# Altium schematic sheet v2下.SchDoc
size A4; SheetNumber: 1; SheetTotal: 1
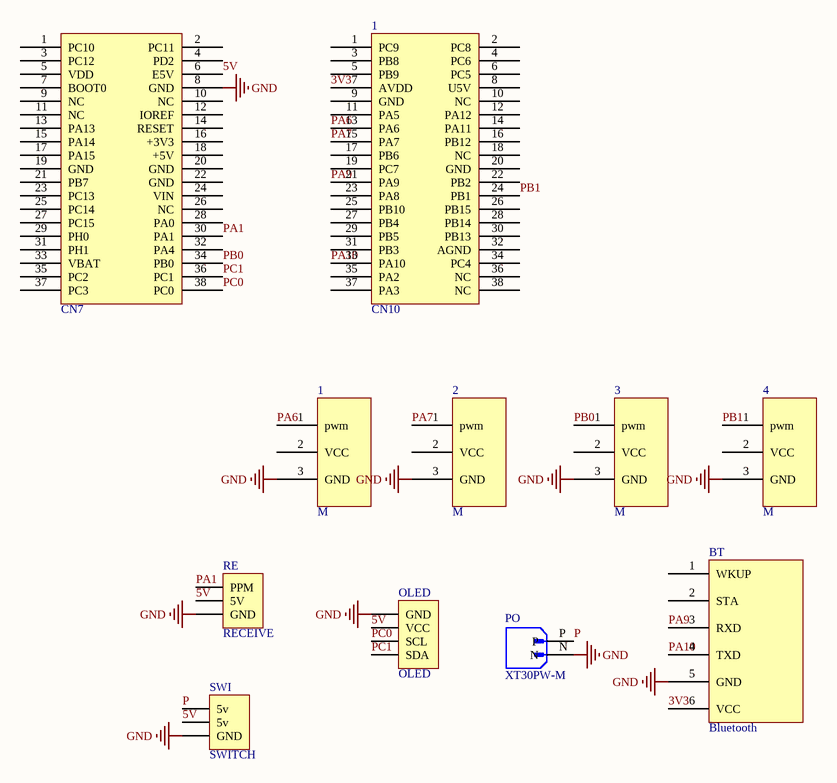
[diagram p0: v2下.SchDoc]

## Parts
(Parts that share a designator on the sheet are numbered #1, #2 ... from top to bottom, then left to right.)
1#1  CN10  [CN10]
1#2  M  [M]
2  M  [M]
3  M  [M]
4  M  [M]
BT  Bluetooth  [Bluetooth]
CN7  CN7  [CN7]  (value not drawn)
OLED  OLED  [HDR1X4]
PO  XT30PW-M  [AMASS_XT30PW-M]
RE  RECEIVE  [HDR1X3]
SWI  SWITCH  [HDR1X3]

## Nets
GND: 1#2.3(GND) 2.3(GND) 3.3(GND) 4.3(GND) BT.5(GND) CN7.8(GND) OLED.1(GND) PO.N RE.3(GND) SWI.3(GND)
3V3: 1#1.7(AVDD) BT.6(VCC)
5V: CN7.6(E5V) OLED.2(VCC) RE.2(5V) SWI.2(5v)
P: PO.P SWI.1(5v)
PA1: CN7.30(PA1) RE.1(PPM)
PA6: 1#1.13(PA6) 1#2.1(pwm)
PA7: 1#1.15(PA7) 2.1(pwm)
PA9: 1#1.21(PA9) BT.3(RXD)
PA10: 1#1.33(PA10) BT.4(TXD)
PB0: 3.1(pwm) CN7.34(PB0)
PB1: 1#1.24(PB1) 4.1(pwm)
PC0: CN7.38(PC0) OLED.3(SCL)
PC1: CN7.36(PC1) OLED.4(SDA)

Not connected (* = marked no-connect by the designer): 1#1 1(PC9) 2(PC8) 3(PB8) 4(PC6) 5(PB9) 6(PC5) 8(U5V) 9(GND) 10(NC) 11(PA5) 12(PA12) 14(PA11) 16(PB12) 17(PB6) 18(NC) 19(PC7) 20(GND) 22(PB2) 23(PA8) 25(PB10) 26(PB15) 27(PB4) 28(PB14) 29(PB5) 30(PB13) 31(PB3) 32(AGND) 34(PC4) 35(PA2) 36(NC) 37(PA3) 38(NC); 1#2 2(VCC); 2 2(VCC); 3 2(VCC); 4 2(VCC); BT 1(WKUP) 2(STA); CN7 1(PC10) 2(PC11) 3(PC12) 4(PD2) 5(VDD) 7(BOOT0) 9(NC) 10(NC) 11(NC) 12(IOREF) 13(PA13) 14(RESET) 15(PA14) 16(+3V3) 17(PA15) 18(+5V) 19(GND) 20(GND) 21(PB7) 22(GND) 23(PC13) 24(VIN) 25(PC14) 26(NC) 27(PC15) 28(PA0) 29(PH0) 31(PH1) 32(PA4) 33(VBAT) 35(PC2) 37(PC3)

## Library data of the parts
OLED = Header 4: Header, 4-Pin; LatestRevisionDate: 17-Jul-2002; LatestRevisionNote: Re-released for DXP Platform.; Publisher: Altium Limited
PO = XT30PW-M: Socket; DC supply; XT30; male; PIN: 2; on PCBs; THT; Colour: yellow; MF: AMASS; Package: None; Price: None; Value: *; SnapEDA_Link: https://www.snapeda.com/parts/XT30PW-M/AMASS/view-part/?ref=snap; MP: XT30PW-M; Availability: Not in stock; Check_prices: https://www.snapeda.com/parts/XT30PW-M/AMASS/view-part/?ref=eda
RE SWI = Header 3: Header, 3-Pin; LatestRevisionDate: 17-Jul-2002; LatestRevisionNote: Re-released for DXP Platform.; Publisher: Altium Limited